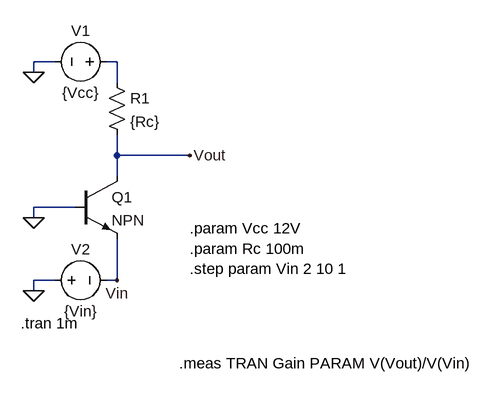
[diagram p0: schematic common.asc]
common.asc, the LTspice schematic file:
Version 4
SHEET 1 880 680
WIRE 96 32 64 32
WIRE 192 32 176 32
WIRE 64 48 64 32
WIRE 192 64 192 32
WIRE 192 176 192 144
WIRE 304 176 192 176
WIRE 192 208 192 176
WIRE 128 256 64 256
WIRE 64 272 64 256
WIRE 96 368 64 368
WIRE 192 368 192 304
WIRE 192 368 176 368
WIRE 64 384 64 368
FLAG 64 272 0
FLAG 64 48 0
FLAG 304 176 Vout
FLAG 64 384 0
FLAG 192 368 Vin
SYMBOL npn 128 208 R0
SYMATTR InstName Q1
SYMBOL res 176 48 R0
SYMATTR InstName R1
SYMATTR Value {Rc}
SYMBOL voltage 192 32 R90
WINDOW 0 -32 56 VBottom 2
WINDOW 3 32 56 VTop 2
WINDOW 123 0 0 Left 0
WINDOW 39 0 0 Left 0
SYMATTR InstName V1
SYMATTR Value {Vcc}
SYMBOL voltage 80 368 M90
WINDOW 0 -32 56 VBottom 2
WINDOW 3 32 56 VTop 2
WINDOW 123 0 0 Left 0
WINDOW 39 0 0 Left 0
SYMATTR InstName V2
SYMATTR Value {Vin}
TEXT 304 288 Left 2 !.param Vcc 12V\n.param Rc 100m\n.step param Vin 2 10 1
TEXT 44 434 Left 2 !.tran 1m
TEXT 288 496 Left 2 !.meas TRAN Gain PARAM V(Vout)/V(Vin)

The netlist it stands for:
* common.asc
Q1 Vout 0 Vin 0 NPN
R1 N001 Vout {Rc}
V1 N001 0 {Vcc}
V2 0 Vin {Vin}
.model NPN NPN
.model PNP PNP
.lib standard.bjt
.param Vcc 12V
.param Rc 100m
.step param Vin 2 10 1
.tran 1m
.meas TRAN Gain PARAM V(Vout)/V(Vin)
.backanno
.end